# EAGLE design tempSensor (EAGLE 6.6.0)
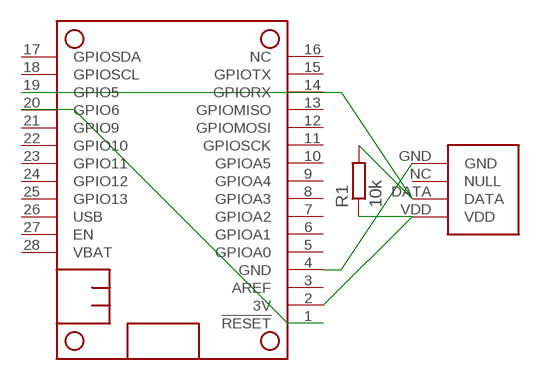
[diagram p0: schematic, sheet 1]

## Parts
MS1  FEATHERWING_NODIM  [FEATHERWING_DIM]
R1  10k  R-EU_0207/10  [0207/10]
U$1  DHT22  [DHT22]

## Nets
3V: MS1.2(3V) R1.1 U$1.VDD
N$1: MS1.1(!RESET) MS1.20(GPIO6)
N$2: MS1.4(GND) U$1.GND
N$3: MS1.19(GPIO5) R1.2 U$1.DATA
Unconnected: MS1.3(AREF) MS1.5(GPIOA0) MS1.6(GPIOA1) MS1.7(GPIOA2) MS1.8(GPIOA3) MS1.9(GPIOA4) MS1.10(GPIOA5) MS1.11(GPIOSCK) MS1.12(GPIOMOSI) MS1.13(GPIOMISO) MS1.14(GPIORX) MS1.15(GPIOTX) MS1.16(NC) MS1.17(GPIOSDA) MS1.18(GPIOSCL) MS1.21(GPIO9) MS1.22(GPIO10) MS1.23(GPIO11) MS1.24(GPIO12) MS1.25(GPIO13) MS1.26(USB) MS1.27(EN) MS1.28(VBAT) U$1.NC(NULL)

## Library data of the parts
MS1 = adafruit:FEATHERWING
R1 = resistor:R-EU_: RESISTOR, European symbol
U$1 = Spark:DHT22

## Board
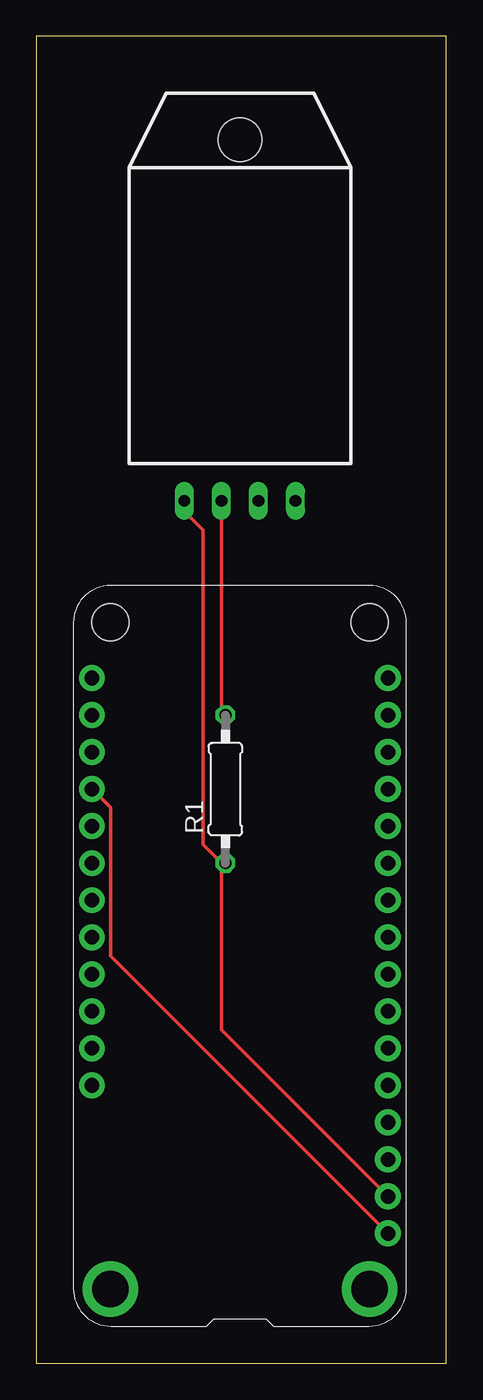
[diagram p1: board, top side]
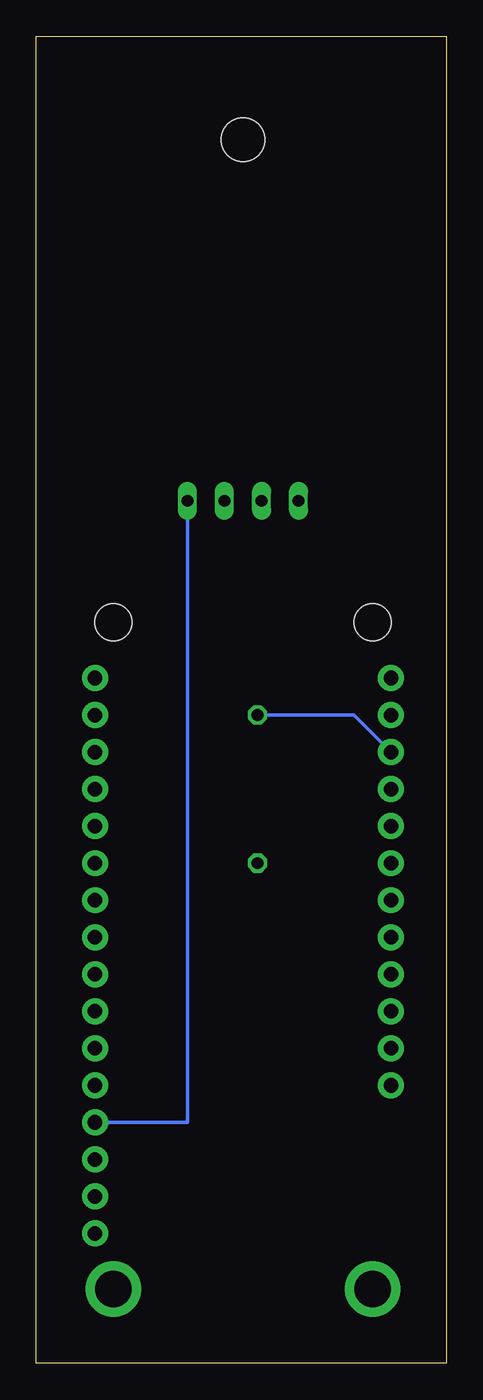
[diagram p2: board, bottom side, seen from below]

Size 28.15 x 91 mm. Coordinates in mm from the lower left corner, seen from the top.
Outline: 0,0 28.15,0 28.15,91 0,91 0,0
Copper layers (1*16): Top 0.035mm / dielectric 1.5mm / Bottom 0.035mm
Design rules "default": minimum track width 10mil, minimum drill 24mil, track to track 8mil, track to pad 8mil, pad to pad 8mil, via to via 8mil, smd to smd 8mil, copper to edge 40mil, drill to drill 8mil, minimum pad ring 10mil, minimum via ring 8mil, stop-mask expansion 4mil, vias tented up to drill 0mil, thermal gap 10mil

### Footprints (pad centres in the part's own frame; a part is rotated, then mirrored left to right if it is on the bottom)
FEATHERWING_DIM = drill 1 pad 1.778: 1 6.35,1.27; 2 8.89,1.27; 3 11.43,1.27; 4 13.97,1.27; 5 16.51,1.27; 6 19.05,1.27; 7 21.59,1.27; 8 24.13,1.27; 9 26.67,1.27; 10 29.21,1.27; 11 31.75,1.27; 12 34.29,1.27; 13 36.83,1.27; 14 39.37,1.27; 15 41.91,1.27; 16 44.45,1.27; 17 44.45,21.59; 18 41.91,21.59; 19 39.37,21.59; 20 36.83,21.59; 21 34.29,21.59; 22 31.75,21.59; 23 29.21,21.59; 24 26.67,21.59; 25 24.13,21.59; 26 21.59,21.59; 27 19.05,21.59; 28 16.51,21.59 | drill 2.5 pad 3.81: P$1 2.54,20.32; P$2 2.54,2.54 | hole 2.54: 48.26,20.32; 48.26,2.54
0207/10 = drill 0.813 octagon: 1 -5.08,0; 2 5.08,0
DHT22 = drill 0.8 long: DATA -1.27,0; GND 3.81,0; NC 1.27,0; VDD -3.81,0 | hole 3: 0,24.765

### Placement (x,y rotation side)
MS1  25.4,2.54 90 top
R1  12.97,39.37 90 top
U$1  13.97,59.15 0 top

### Tracks (layer width: path | path; a pad name or v marks a point on that pad's centre or on a via)
3V
  Top 0.254: 12.7,34.29 11.43,35.56 11.43,57.15 10.16,58.42 U$1.VDD | MS1.2 12.7,22.86 12.7,34.29 | 12.7,34.29 R1.1
N$1
  Top 0.254: MS1.1 5.08,27.94 5.08,38.1 MS1.20
N$2
  Bottom 0.254: U$1.GND 17.78,16.51 MS1.4
N$3
  Top 0.254: U$1.DATA 12.7,44.45 R1.2
  Bottom 0.254: MS1.19 6.35,44.45 R1.2